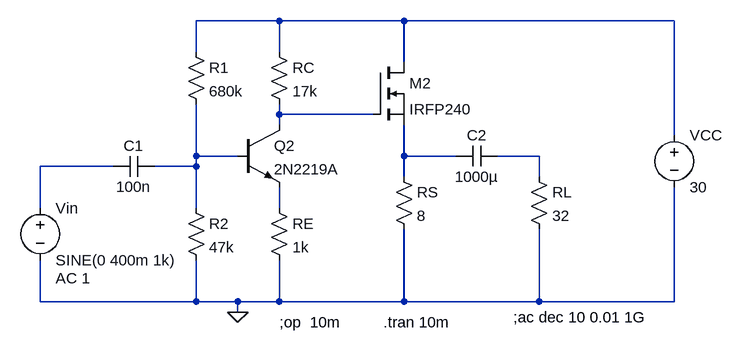
[diagram p0: schematic AC and Transient Response.asc]
AC and Transient Response.asc, the LTspice schematic file:
Version 4
SHEET 1 1016 680
WIRE 336 -160 208 -160
WIRE 528 -160 336 -160
WIRE 944 -160 528 -160
WIRE 208 -112 208 -160
WIRE 336 -112 336 -160
WIRE 528 -96 528 -160
WIRE 336 -16 336 -32
WIRE 480 -16 336 -16
WIRE 336 0 336 -16
WIRE 944 16 944 -160
WIRE 208 48 208 -32
WIRE 272 48 208 48
WIRE 528 48 528 0
WIRE 608 48 528 48
WIRE 736 48 672 48
WIRE 80 64 -32 64
WIRE 208 64 208 48
WIRE 208 64 144 64
WIRE 528 80 528 48
WIRE 736 80 736 48
WIRE -32 128 -32 64
WIRE 208 128 208 64
WIRE 336 128 336 96
WIRE -32 272 -32 208
WIRE 208 272 208 208
WIRE 208 272 -32 272
WIRE 272 272 208 272
WIRE 336 272 336 208
WIRE 336 272 272 272
WIRE 528 272 528 160
WIRE 528 272 336 272
WIRE 736 272 736 160
WIRE 736 272 528 272
WIRE 944 272 944 96
WIRE 944 272 736 272
WIRE 272 288 272 272
FLAG 272 288 0
SYMBOL voltage -32 112 R0
WINDOW 123 24 124 Left 2
WINDOW 39 0 0 Left 0
SYMATTR Value2 AC 1
SYMATTR InstName Vin
SYMATTR Value SINE(0 400m 1k)
SYMBOL voltage 944 0 R0
SYMATTR InstName VCC
SYMATTR Value 30
SYMBOL cap 144 48 R90
WINDOW 0 0 32 VBottom 2
WINDOW 3 32 32 VTop 2
SYMATTR InstName C1
SYMATTR Value 100n
SYMBOL cap 672 32 R90
WINDOW 0 0 32 VBottom 2
WINDOW 3 32 32 VTop 2
SYMATTR InstName C2
SYMATTR Value 1000µ
SYMBOL res 192 -128 R0
SYMATTR InstName R1
SYMATTR Value 680k
SYMBOL res 192 112 R0
SYMATTR InstName R2
SYMATTR Value 47k
SYMBOL res 320 -128 R0
SYMATTR InstName RC
SYMATTR Value 17k
SYMBOL res 320 112 R0
SYMATTR InstName RE
SYMATTR Value 1k
SYMBOL res 512 64 R0
SYMATTR InstName RS
SYMATTR Value 8
SYMBOL res 720 64 R0
SYMATTR InstName RL
SYMATTR Value 32
SYMBOL npn 272 0 R0
SYMATTR InstName Q2
SYMATTR Value 2N2219A
SYMBOL nmos 480 -96 R0
SYMATTR InstName M2
SYMATTR Value IRFP240
TEXT 336 304 Left 2 !;op  10m
TEXT 496 304 Left 2 !.tran 10m
TEXT 696 296 Left 2 !;ac dec 10 0.01 1G

The netlist it stands for:
* AC and Transient Response.asc
Vin N006 0 SINE(0 400m 1k) AC 1
VCC N001 0 30
C1 N003 N006 100n
C2 N005 N004 1000µ
R1 N001 N003 680k
R2 N003 0 47k
RC N001 N002 17k
RE N007 0 1k
RS N004 0 8
RL N005 0 32
Q2 N002 N003 N007 0 2N2219A
M2 N001 N002 N004 N004 IRFP240
.model NPN NPN
.model PNP PNP
.lib standard.bjt
.model NMOS NMOS
.model PMOS PMOS
.lib standard.mos
;op  10m
.tran 10m
;ac dec 10 0.01 1G
.backanno
.end